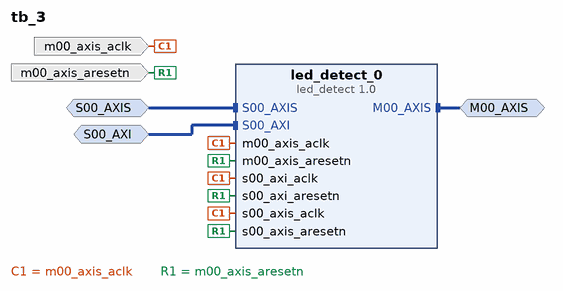
[diagram p0: block diagram of the top level]
# Vivado block design tb_3, Vivado 2016.2
create_bd_design tb_3

create_bd_intf_port -mode Slave -vlnv xilinx.com:interface:axis_rtl:1.0 S00_AXIS
set_property -dict [list \
  CONFIG.TDATA_NUM_BYTES 3 \
  CONFIG.TDEST_WIDTH 0 \
  CONFIG.TID_WIDTH 0 \
  CONFIG.TUSER_WIDTH 0 \
  CONFIG.HAS_TREADY 1 \
  CONFIG.HAS_TSTRB 1 \
  CONFIG.HAS_TKEEP 0 \
  CONFIG.HAS_TLAST 1 \
  CONFIG.LAYERED_METADATA undef \
] [get_bd_intf_ports S00_AXIS]
create_bd_intf_port -mode Slave -vlnv xilinx.com:interface:aximm_rtl:1.0 S00_AXI
set_property -dict [list \
  CONFIG.DATA_WIDTH 32 \
  CONFIG.PROTOCOL AXI4LITE \
  CONFIG.ID_WIDTH 0 \
  CONFIG.ADDR_WIDTH 5 \
  CONFIG.AWUSER_WIDTH 0 \
  CONFIG.ARUSER_WIDTH 0 \
  CONFIG.WUSER_WIDTH 0 \
  CONFIG.RUSER_WIDTH 0 \
  CONFIG.BUSER_WIDTH 0 \
  CONFIG.READ_WRITE_MODE READ_WRITE \
  CONFIG.HAS_BURST 0 \
  CONFIG.HAS_LOCK 0 \
  CONFIG.HAS_PROT 1 \
  CONFIG.HAS_CACHE 0 \
  CONFIG.HAS_QOS 0 \
  CONFIG.HAS_REGION 0 \
  CONFIG.HAS_WSTRB 1 \
  CONFIG.HAS_BRESP 1 \
  CONFIG.HAS_RRESP 1 \
  CONFIG.SUPPORTS_NARROW_BURST 0 \
  CONFIG.NUM_READ_OUTSTANDING 1 \
  CONFIG.NUM_WRITE_OUTSTANDING 1 \
  CONFIG.MAX_BURST_LENGTH 1 \
] [get_bd_intf_ports S00_AXI]
create_bd_intf_port -mode Master -vlnv xilinx.com:interface:axis_rtl:1.0 M00_AXIS
create_bd_port -dir I -type clk m00_axis_aclk
create_bd_port -dir I -type rst m00_axis_aresetn

create_bd_cell -type ip -vlnv user:user:led_detect:1.0 led_detect_0

# ---- connections ----

connect_bd_intf_net [get_bd_intf_ports S00_AXIS] [get_bd_intf_pins led_detect_0/S00_AXIS]
connect_bd_intf_net [get_bd_intf_ports S00_AXI] [get_bd_intf_pins led_detect_0/S00_AXI]
connect_bd_intf_net [get_bd_intf_ports M00_AXIS] [get_bd_intf_pins led_detect_0/M00_AXIS]
connect_bd_net [get_bd_ports m00_axis_aclk] \
  [get_bd_pins led_detect_0/m00_axis_aclk] [get_bd_pins led_detect_0/s00_axi_aclk] [get_bd_pins led_detect_0/s00_axis_aclk]
connect_bd_net [get_bd_ports m00_axis_aresetn] \
  [get_bd_pins led_detect_0/m00_axis_aresetn] [get_bd_pins led_detect_0/s00_axi_aresetn] \
  [get_bd_pins led_detect_0/s00_axis_aresetn]

validate_bd_design
save_bd_design
